# Altium schematic sheet 6 RF Ports.SchDoc: RF Ports
size A3; PageSetup: Record=PageOptions|CenterHorizontal=True|CenterVertical=True|PrintScale=1.01|XCorrection=1.00|YCorrection=1.00|PrintKind=2|BorderSize=5000000|LeftOffset=0|BottomOffset=0|Orientation=2|PaperLength=1000|PaperWidth=1000|Scale=100|PaperSource=15|PrintQuality=600|MediaType=1|DitherType=10|PaperKind=A3|PrintScaleMode=1; DocumentNumber: 4; SheetNumber: 7; SheetTotal: 7
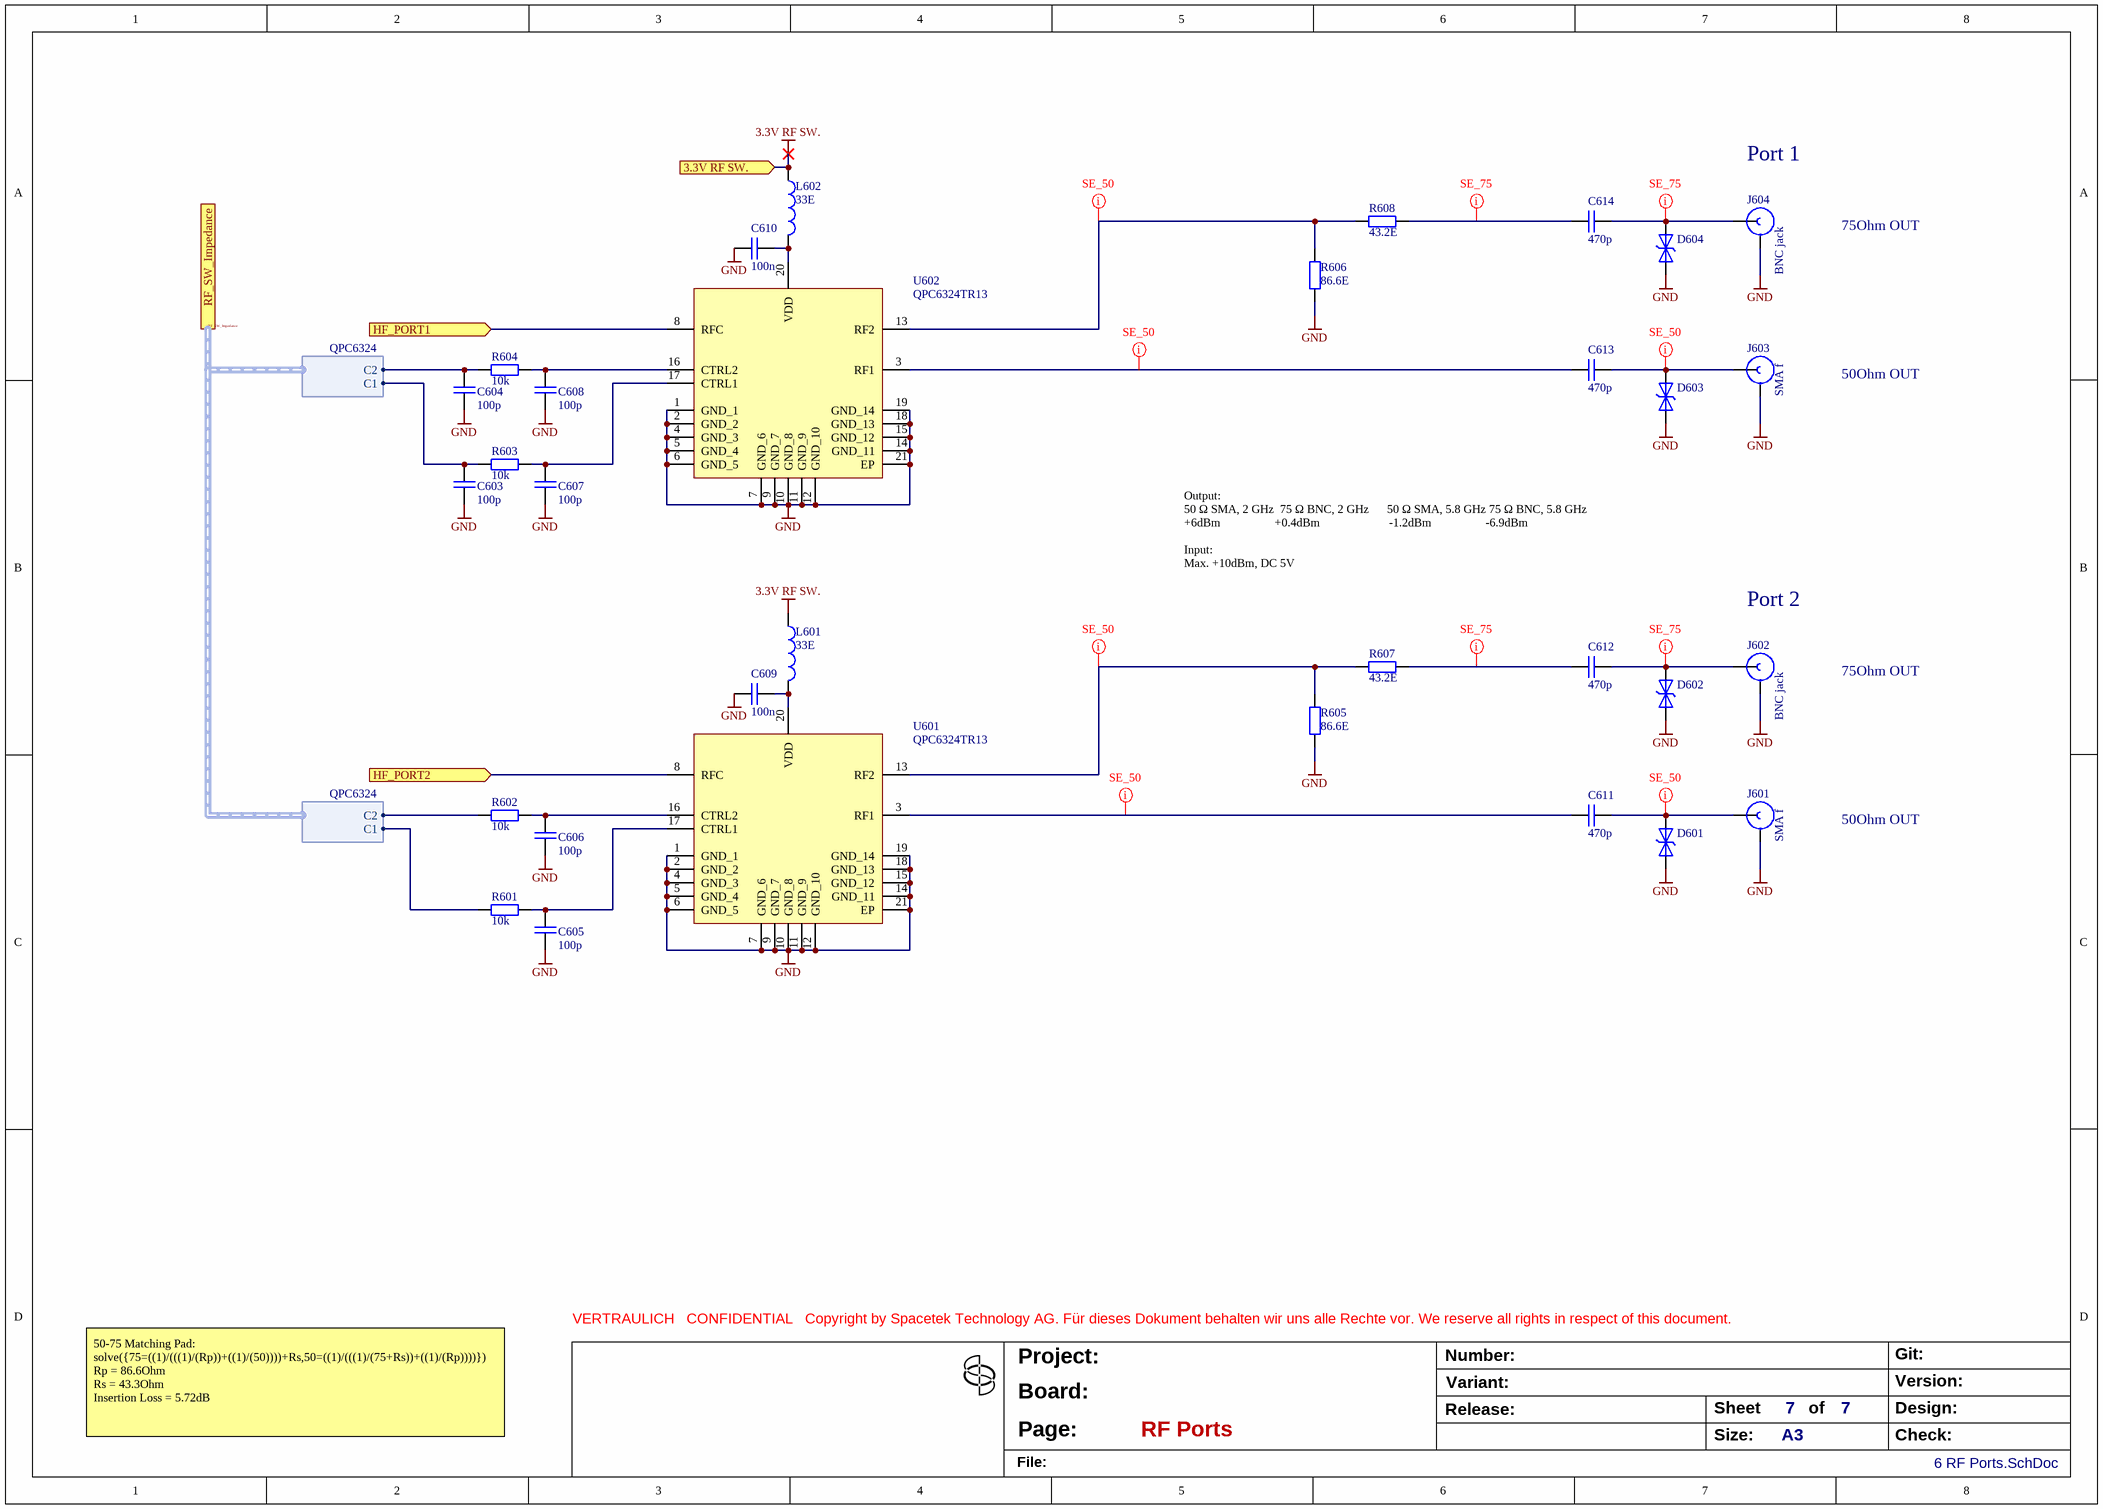
[diagram p0: 6 RF Ports.SchDoc]

## Parts
C603  100p  [STT--CC--0402]
C604  100p  [STT--CC--0402]
C605  100p  [STT--CC--0402]
C606  100p  [STT--CC--0402]
C607  100p  [STT--CC--0402]
C608  100p  [STT--CC--0402]
C609  100n  [STT--CC--0402]
C610  100n  [STT--CC--0402]
C611  470p  [STT--CC--0402]
C612  470p  [STT--CC--0402]
C613  470p  [STT--CC--0402]
C614  470p  [STT--CC--0402]
D601  SESD0402X1BN-0010-098  [LF--SD--0402R]  (value not drawn)
D602  SESD0402X1BN-0010-098  [LF--SD--0402R]  (value not drawn)
D603  SESD0402X1BN-0010-098  [LF--SD--0402R]  (value not drawn)
D604  SESD0402X1BN-0010-098  [LF--SD--0402R]  (value not drawn)
J601  SMA f  [STT--CO--142-0701-871]
J602  BNC jack  [SAM--CO--BNC7T-J-P-GN-RA-BM1D]
J603  SMA f  [STT--CO--142-0701-871]
J604  BNC jack  [SAM--CO--BNC7T-J-P-GN-RA-BM1D]
L601  33E  [STT--FB--0402]
L602  33E  [STT--FB--0402]
R601  10k  [STT--RC--0402]
R602  10k  [STT--RC--0402]
R603  10k  [STT--RC--0402]
R604  10k  [STT--RC--0402]
R605  86.6E  [STT--RC--0402]
R606  86.6E  [STT--RC--0402]
R607  43.2E  [STT--RC--0402]
R608  43.2E  [STT--RC--0402]
U601  QPC6324TR13  [QV--IC--QFN-20]
U602  QPC6324TR13  [QV--IC--QFN-20]

## Ports
3.3V RF SW. (in), HF_PORT1 (in), HF_PORT2 (in), RF_SW_Impedance (harness QPC6324)

## Harnesses
QPC6324: C1, C2

## Nets
3.3V RF SW.: L601.1 L602.1 ; port 3.3V RF SW.
GND: C603.1 C604.1 C605.1 C606.1 C607.1 C608.1 C609.1 C610.1 D601.1 D602.1 D603.1 D604.1 J601.0 J602.0 J603.0 J604.0 R605.2 R606.2 U601.1(GND_1) U601.2(GND_2) U601.4(GND_3) U601.5(GND_4) U601.6(GND_5) U601.7(GND_6) U601.9(GND_7) U601.10(GND_8) U601.11(GND_9) U601.12(GND_10) U601.14(GND_11) U601.15(GND_12) U601.18(GND_13) U601.19(GND_14) U601.21(EP) U602.1(GND_1) U602.2(GND_2) U602.4(GND_3) U602.5(GND_4) U602.6(GND_5) U602.7(GND_6) U602.9(GND_7) U602.10(GND_8) U602.11(GND_9) U602.12(GND_10) U602.14(GND_11) U602.15(GND_12) U602.18(GND_13) U602.19(GND_14) U602.21(EP)
HF_PORT1: U602.8(RFC) ; port HF_PORT1
HF_PORT2: U601.8(RFC) ; port HF_PORT2
RF_SW_Impedance.C1: C603.2 R601.2 R603.2 ; port RF_SW_Impedance.C1
RF_SW_Impedance.C2: C604.2 R602.2 R604.2 ; port RF_SW_Impedance.C2
NetC605_2: C605.2 R601.1 U601.17(CTRL1)
NetC606_2: C606.2 R602.1 U601.16(CTRL2)
NetC607_2: C607.2 R603.1 U602.17(CTRL1)
NetC608_2: C608.2 R604.1 U602.16(CTRL2)
NetC609_2: C609.2 L601.2 U601.20(VDD)
NetC610_2: C610.2 L602.2 U602.20(VDD)
NetC611_1: C611.1 U601.3(RF1)
NetC611_2: C611.2 D601.2 J601.1
NetC612_1: C612.1 R607.1
NetC612_2: C612.2 D602.2 J602.1
NetC613_1: C613.1 U602.3(RF1)
NetC613_2: C613.2 D603.2 J603.1
NetC614_1: C614.1 R608.1
NetC614_2: C614.2 D604.2 J604.1
NetR605_1: R605.1 R607.2 U601.13(RF2)
NetR606_1: R606.1 R608.2 U602.13(RF2)

## Buses and harness runs
harness RF_SW_Impedance = port RF_SW_Impedance

## Layout directives
net class SE_50: NetC611_1, NetC611_2, NetC613_1, NetC613_2, NetR605_1, NetR606_1
net class SE_75: NetC612_1, NetC612_2, NetC614_1, NetC614_2

## Notes on the sheet
- Port 1
- 75Ohm OUT
- 50Ohm OUT
- Output:
  50 Ω SMA, 2 GHz 	75 Ω BNC, 2 GHz	     50 Ω SMA, 5.8 GHz	75 Ω BNC, 5.8 GHz
  +6dBm	                 +0.4dBm	                      -1.2dBm	                 -6.9dBm
  Input:
  Max. +10dBm, DC 5V
- Port 2
- 50-75 Matching Pad:
  solve({75=((1)/(((1)/(Rp))+((1)/(50))))+Rs,50=((1)/(((1)/(75+Rs))+((1)/(Rp))))})
  Rp = 86.6Ohm
  Rs = 43.3Ohm
  Insertion Loss = 5.72dB
- VERTRAULICH   CONFIDENTIAL   Copyright by Spacetek Technology AG. Für dieses Dokument behalten wir uns alle Rechte vor. We reserve all rights in respect of this document.
- Project:
- Number:
- Variant:
- Version:
- Git:
- Board:
- Page:
- Release:
- Size:
- Sheet
- A3
- of
- Design:
- Check:
- File:

## Library data of the parts
C603-C608 = CMP-010-000109-1: Capacitor ceramic 100p 50V 5% C0G AEC-Q200 SMD--0402; Partnumber: CL05C101JB51PND; Manufacturer: Samsung Electro-Mechanics; Component Category: Generic; Meta Data Version: v1.0; Package: SMD--0402; Status: released; Type: Capacitor ceramic; Value: 100p
C609 C610 = 200032-3: Capacitor ceramic 100n 16V 10% X7R  SMD--0402; Partnumber: CL05B104KO5NNNC; Manufacturer: Samsung Electro-Mechanics; A-Number: 200032; Material: X7R; Voltage: 16V; Type: Capacitor ceramic; Tolerance: 10%; Status: released; Package: SMD--0402; Value: 100n
C611-C614 = CMP-010-000105-1: Capacitor ceramic 470p 50V 5% C0G  SMD--0402; Manufacturer: TDK; Partnumber: CGA2B2C0G1H471J050BA; Component Category: Generic; Meta Data Version: v1.0; Status: released; Value: 470p
D601-D604 = CMP-039-000055-1: TVS Diode, 7V, 0.1pF; Manufacturer: Littelfuse; Meta Data Version: v1.0; Component Category: Generic; Type: TVS Diode; Partnumber: SESD0402X1BN-0010-098; Status: released; Value: SESD0402X1BN-0010-098
J601 J603 = 600000-2: Connector Coaxial 142-0701-871 SMA f  Edge--142-0701-871; Manufacturer: Chinch Connectivity Solutions Johnson; preferred: yes; A-Number: 600000; E-Number: E-000'342; Status: active; Partnumber: 142-0701-871; Type: Connector Coaxial; Value: SMA f; Package: Edge--142-0701-871
J602 J604 = CMP-023-000176-1: Connector Coaxial BNC7T-J-P-GN-RA-BM1D BNC jack right angle 75Ohm; Manufacturer: Samtec; Meta Data Version: v1.0; Component Category: Generic; Type: Connector Coaxial; Special: right angle; Value: BNC jack; Status: released; Partnumber: BNC7T-J-P-GN-RA-BM1D
L601 L602 = 300015-1: Ferrit Bead MPZ1005S330HT000 33E 3A 22mE SMD--0402; Manufacturer: TDK Group; preferred: Yes; A-Number: 300015; Status: active; Current: 3A; Type: Ferrit Bead; Value: 33E; Package: MPZ1005S330HT000; Special: 22mE; Partnumber: MPZ1005S330HT000
R601-R604 = 100086-1: Resistor 10k 50V  0.063W 1%  SMD--0402; Partnumber: ERJ-2RKF1002X; Manufacturer: Panasonic; A-Number: 100086; Power: 0.063W; Status: released; Type: Resistor; Voltage: 50V; Tolerance: 1%; Value: 10k; Package: SMD--0402
R605 R606 = CMP-009-000267-1: Resistor 86.6E 50V 0.1W 0.1% SMD--0402; Manufacturer: TE Connectivity; Partnumber: RP73PF1E86R6BTD; Meta Data Version: v1.0; Component Category: Generic; Value: 86.6E; Type: Resistor; Status: released
R607 R608 = CMP-009-000266-1: Resistor 43.2E 50V 0.1W 0.1% SMD--0402; Manufacturer: TE Connectivity; Partnumber: RP73PF1E43R2BTD; Component Category: Generic; Meta Data Version: v1.0; Status: released; Value: 43.2E; Type: Resistor
U601 U602 = CMP-081-000012-1: RF Switch QPC6324TR13  5-6000MHz SPDT; Manufacturer: Qorvo; Component Category: Generic; Meta Data Version: v1.0; Value: QPC6324TR13; Partnumber: QPC6324TR13; Status: released; Type: RF-Switch